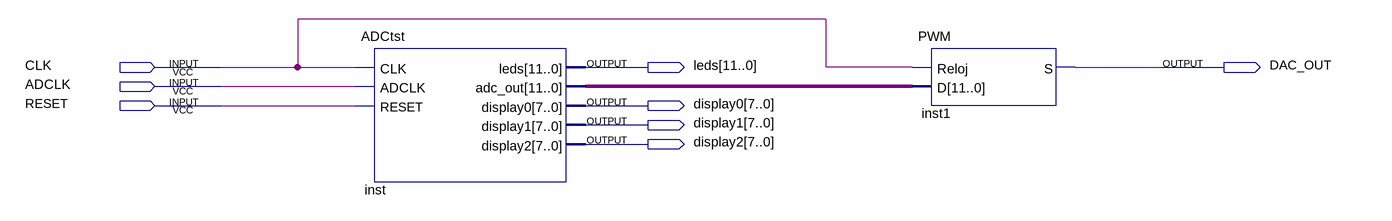
[diagram p0: schematic sheet]
// Quartus schematic DAC_test.bdf as structural Verilog: 2 symbols, 8 pins
module DAC_test (
  input  CLK,
  input  ADCLK,
  input  RESET,
  output [11:0] leds,
  output DAC_OUT,
  output [7:0] display0,
  output [7:0] display1,
  output [7:0] display2
);

  wire [11:0] inst_adc_out;

  ADCtst inst (
    .CLK(CLK), .ADCLK(ADCLK), .RESET(RESET), .leds(leds), .adc_out(inst_adc_out), .display0(display0),
    .display1(display1), .display2(display2));
  PWM inst1 (.Reloj(CLK), .D(inst_adc_out), .S(DAC_OUT));
endmodule
